# Altium schematic sheet TopLevel.SchDoc
size A4; SheetNumber: 1; SheetTotal: 6
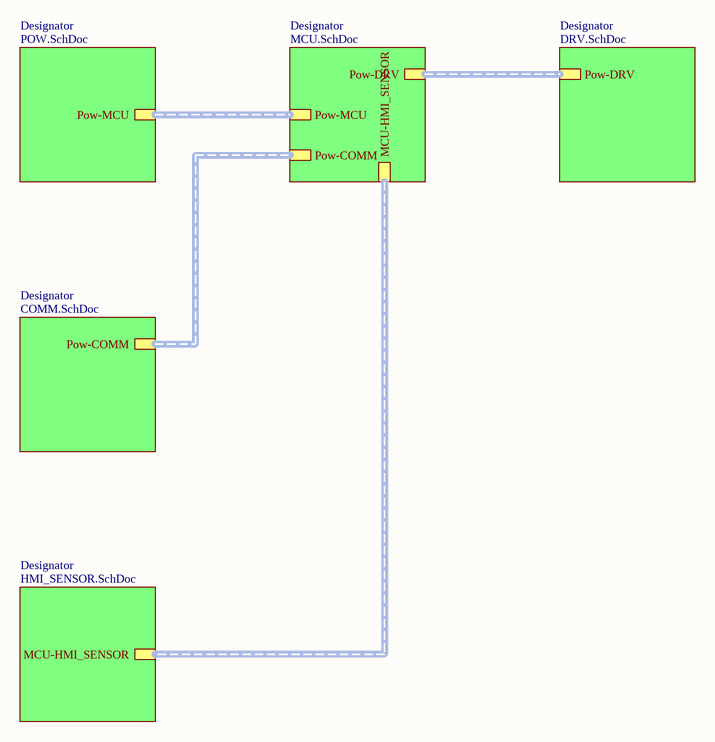
[diagram p0: TopLevel.SchDoc]

## Sub-sheets
Designator = POW.SchDoc: Pow-MCU (harness Pow-MCU)
Designator = MCU.SchDoc: Pow-MCU (harness Pow-MCU), Pow-DRV (harness Pow-DRV), MCU-HMI_SENSOR (harness Pow-MCU), Pow-COMM (harness Pow-COMM)
Designator = DRV.SchDoc: Pow-DRV (harness Pow-DRV)
Designator = COMM.SchDoc: Pow-COMM (harness Pow-COMM)
Designator = HMI_SENSOR.SchDoc: MCU-HMI_SENSOR (harness Pow-HMI_SENSOR)